# Altium schematic sheet DelayLine.SchDoc: Наименование
size 420 x 297 mm; ApprovedBy: Утвердил; CheckedBy: Проверил; Author: Разработал; CompanyName: Организация; DrawnBy: Н.Контр; Engineer: Т.Контр; SheetNumber: 1; SheetTotal: 1; PageSetup: Record=PageOptions|CenterHorizontal=True|CenterVertical=True|PrintScale=0.94|XCorrection=1.00|YCorrection=1.00|PrintKind=1|BorderSize=5000000|LeftOffset=0|BottomOffset=0|Orientation=1|PaperLength=1000|PaperWidth=1000|Scale=100|PaperSource=7|PrintQuality=-4|MediaType=1|DitherType=10|PaperKind=A4|PrintScaleMode=1; DecimalNumber: DelayLine; HeadOfSector: Нач. сектора; MainDevice: Перв.примен.; Name: Наименование; DocumentName: Sheet1.SCHDOC
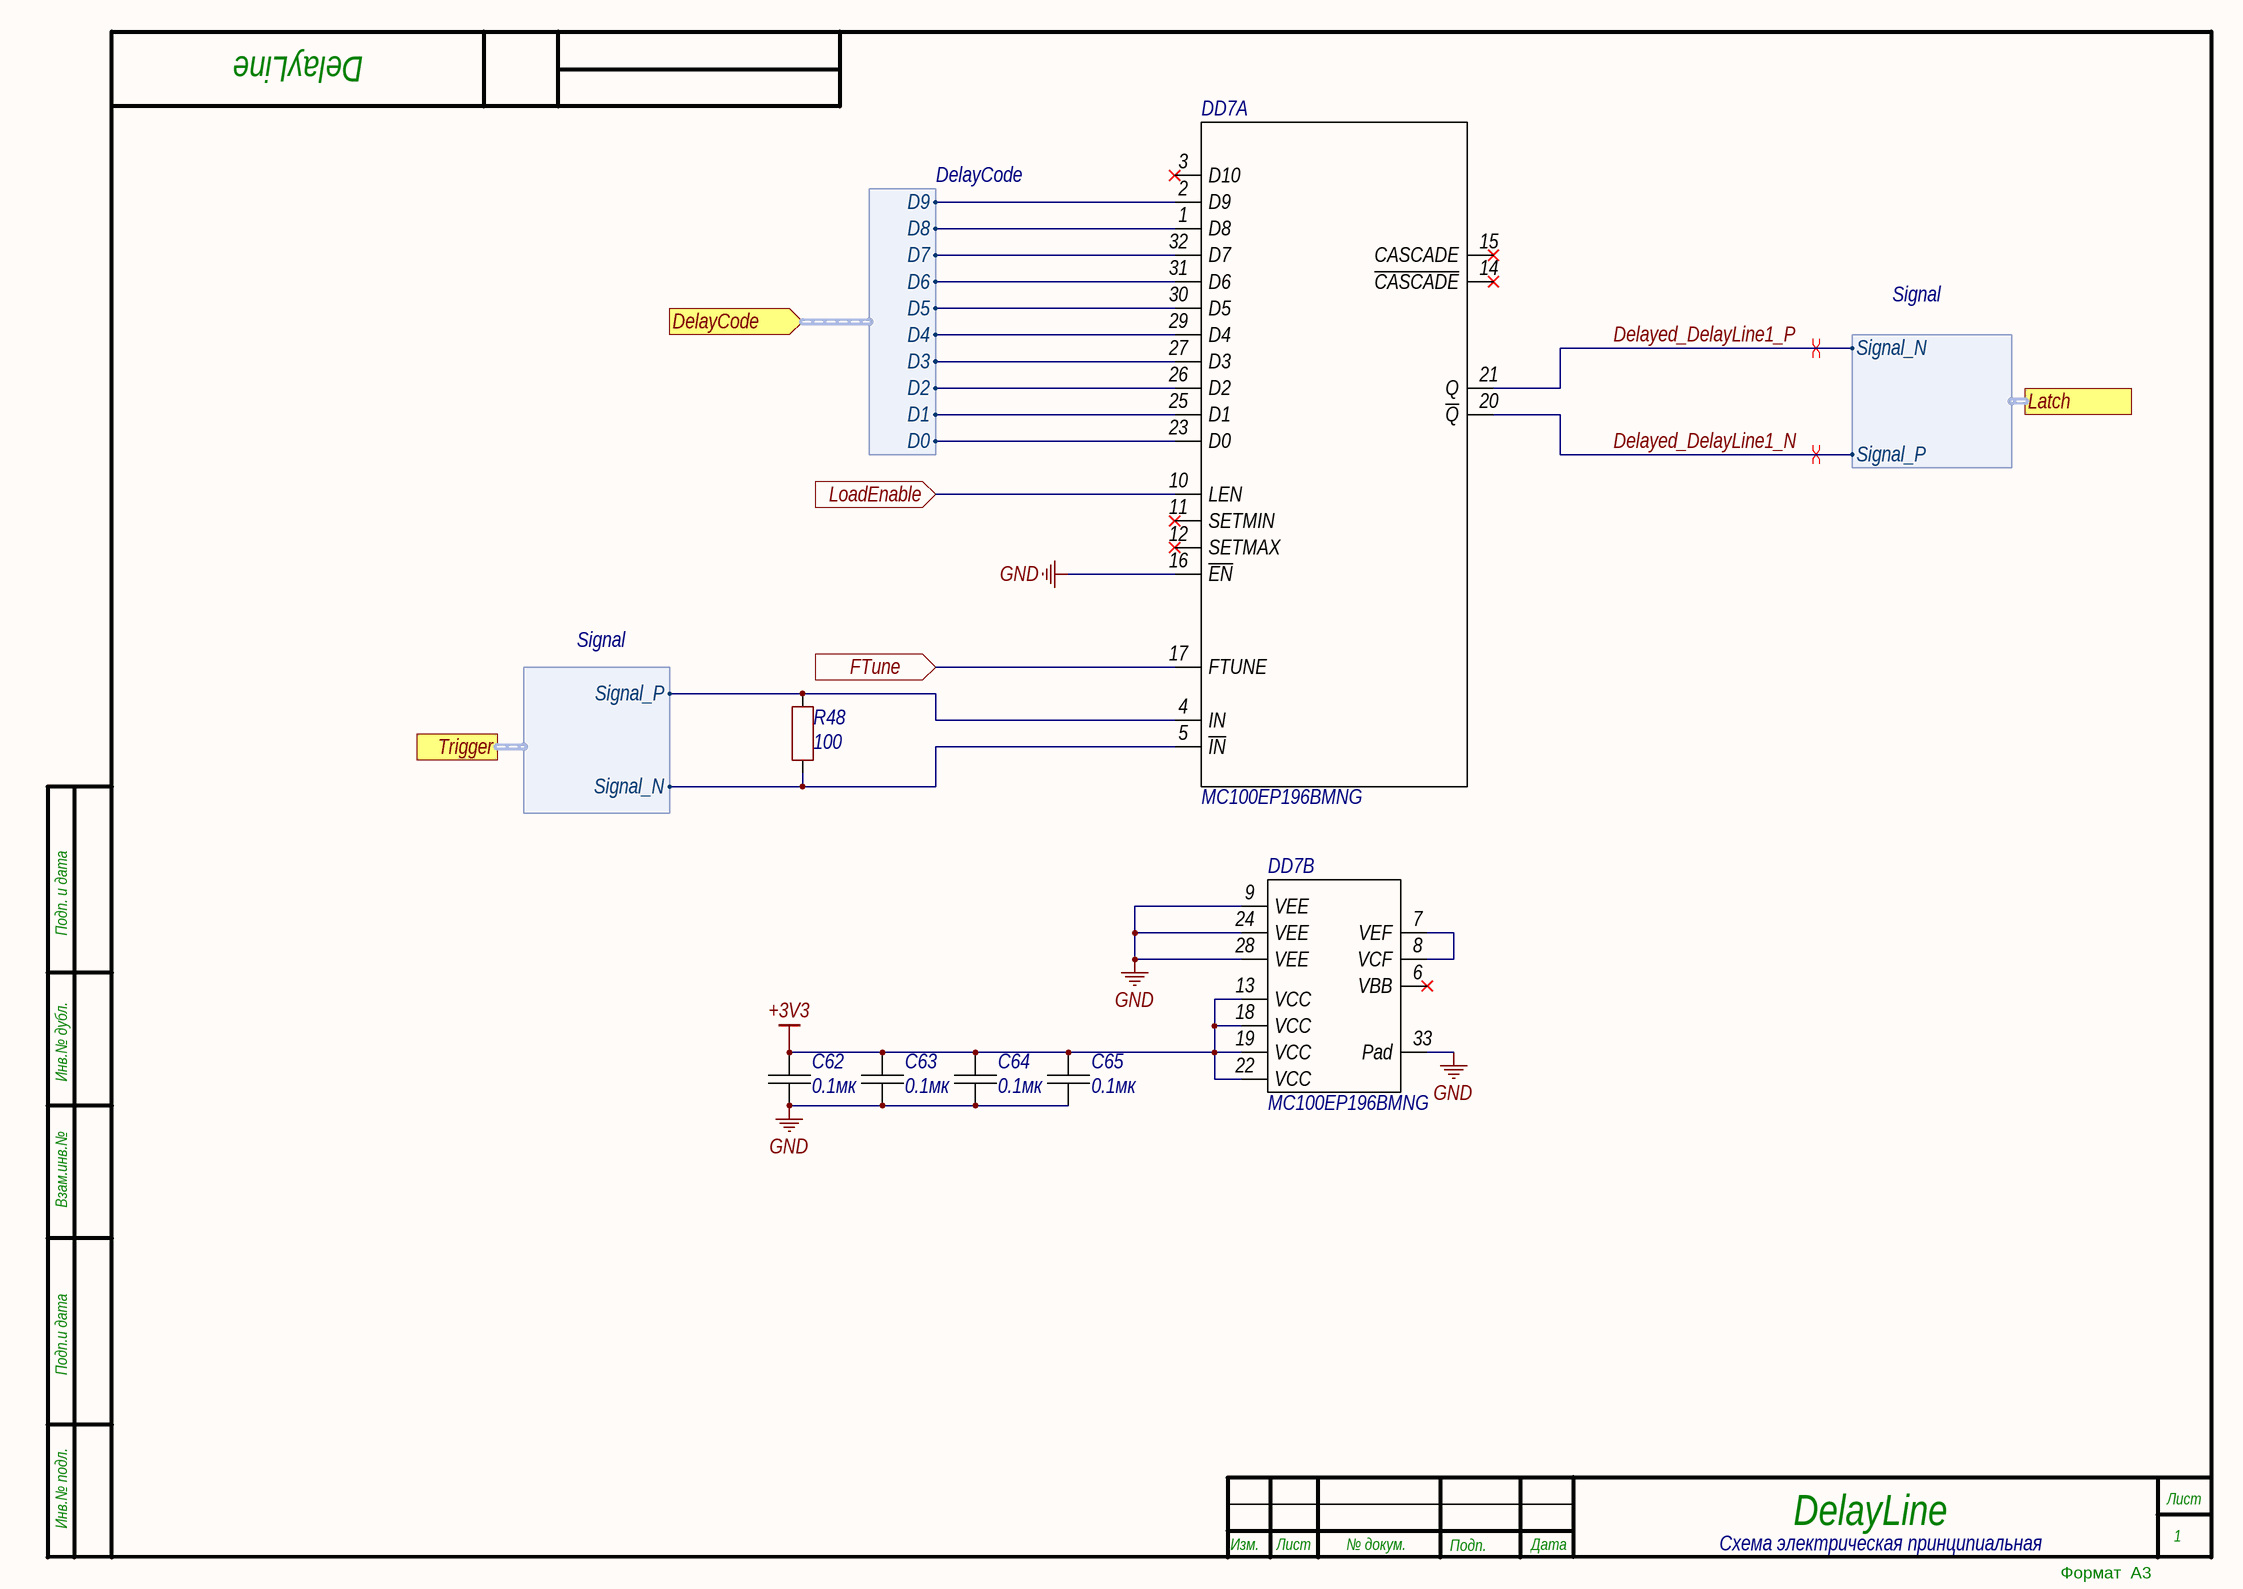
[diagram p0: DelayLine.SchDoc]

## Parts
C62  value 0.1мк  [CAP0402]  (hidden comment: 0.1мк *)
C63  value 0.1мк  [CAP0402]  (hidden comment: 0.1мк *)
C64  value 0.1мк  [CAP0402]  (hidden comment: 0.1мк *)
C65  value 0.1мк  [CAP0402]  (hidden comment: 0.1мк *)
DD7  MC100EP196BMNG  [QFN-32_N_TP]  (parts A,B of 2)
R48  100  [RESC0402(1005)_M]

## Ports
DelayCode (in, harness DelayCode), FTune (in), Latch (harness Signal), LoadEnable (in), Trigger (harness Signal)

## Harnesses
Signal: Signal_P, Signal_N
Signal: Signal_N, Signal_P
DelayCode: D9, D8, D7, D6, D5, D4, D3, D2, D1, D0

## Nets
+3V3: C62.1 C63.1 C64.1 C65.1 DD7.13(VCC) DD7.18(VCC) DD7.19(VCC) DD7.22(VCC)
GND: C62.2 C63.2 C64.2 C65.2 DD7.9(VEE) DD7.16(~{EN}) DD7.24(VEE) DD7.28(VEE) DD7.33(Pad)
Delayed_DelayLine1_N: DD7.20(~{Q}) ; port Latch.Signal_P
Delayed_DelayLine1_P: DD7.21(Q) ; port Latch.Signal_N
FTune: DD7.17(FTUNE) ; port FTune
LoadEnable: DD7.10(LEN) ; port LoadEnable
NetDD7_1: DD7.1(D8) ; port DelayCode.D8
NetDD7_2: DD7.2(D9) ; port DelayCode.D9
NetDD7_4: DD7.4(IN) R48.2 ; port Trigger.Signal_P
NetDD7_5: DD7.5(~{IN}) R48.1 ; port Trigger.Signal_N
NetDD7_7: DD7.7(VEF) DD7.8(VCF)
NetDD7_23: DD7.23(D0) ; port DelayCode.D0
NetDD7_25: DD7.25(D1) ; port DelayCode.D1
NetDD7_26: DD7.26(D2) ; port DelayCode.D2
NetDD7_27: DD7.27(D3) ; port DelayCode.D3
NetDD7_29: DD7.29(D4) ; port DelayCode.D4
NetDD7_30: DD7.30(D5) ; port DelayCode.D5
NetDD7_31: DD7.31(D6) ; port DelayCode.D6
NetDD7_32: DD7.32(D7) ; port DelayCode.D7

Not connected (* = marked no-connect by the designer): DD7 3(D10)* 6(VBB)* 11(SETMIN)* 12(SETMAX)* 14(~{CASCADE})* 15(CASCADE)*

## Layout directives
differential pair; differential pair class LVDS/PECL: Delayed_DelayLine1_N, Delayed_DelayLine1_P

## Notes on the sheet
- Схема электрическая принципиальная
- Подп. и дата
- Инв.№ дубл.
- Взам.инв.№
- Подп.и дата
- Инв.№ подл.
- Изм.
- Лист
- № докум.
- Подп.
- Дата
- Формат  A3

## Library data of the parts
C62-C65 = CAP0402: MntType: SMD; MSL: MSL 1; Package: =Footprint; RoHS: Comply; PartType: CHIP CERAMIC CAPACITOR; Pins: 2; BOMDescription: =MntType+' '+PartType+' '+Package+' '+Value+' '+Tolerance+' '+Voltage+' '+TempCoeff+' '+MPN; CFootprint: =Footprint; Voltage: *; Part Number: CAP0402; ClassName: Capacitor; ComponentLink1Description: Datasheet
DD7 = MC100EP196BMNG: MANUFACTURER: ONSEMI; MNTTYPE: SMD; MPN: MC100EP196BMNG; PART NUMBER: MC100EP196BMNG; MSL: MSL 1; PACKAGE: QFN-32; ROHS: Comply; PARTTYPE: Delay Line; PINS: 32; BOMDESCRIPTION: =MntType+' '+PartType+' '+Package+' '+Value+' '+Tolerance+' '+Voltage+' '+TempCoeff+' '+MPN; CFOOTPRINT: =Footprint; CLASSNAME: DelayLine; COMPONENTLINK1DESCRIPTION: Datasheet; COMPONENTLINK1URL: https://eu.mouser.com/datasheet/2/308/1/MC100EP196B_D-2315397.pdf
R48 = RES0402: MntType: SMD; MSL: MSL 1; Package: =Footprint; RoHS: Comply; PartType: CHIP RESISTOR; Pins: 2; BOMDescription: =MntType+' '+PartType+' '+Package+' '+Value+' '+Tolerance+' '+Voltage+' '+TempCoeff+' '+MPN; CFootprint: =Footprint; Value: 100; Part Number: RES0402; ClassName: Resistor; ComponentLink1Description: Datasheet